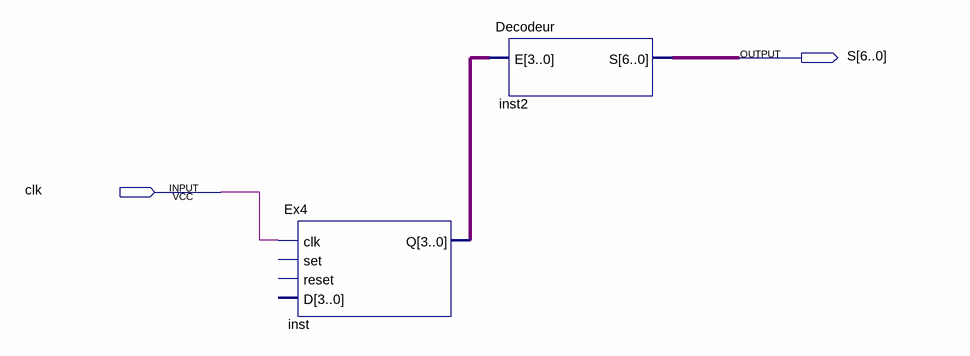
[diagram p0: schematic sheet]
// Quartus schematic CompteurDecodeur_SCHEME.bdf as structural Verilog: 2 symbols, 2 pins
module CompteurDecodeur_SCHEME (
  input  clk,
  output [6:0] S
);

  wire [3:0] inst_q;

  Ex4 inst (.clk(clk), .Q(inst_q));  // open: set, reset, D
  Decodeur inst2 (.E(inst_q), .S(S));
endmodule
